# Altium project DMC02.PrjPcb
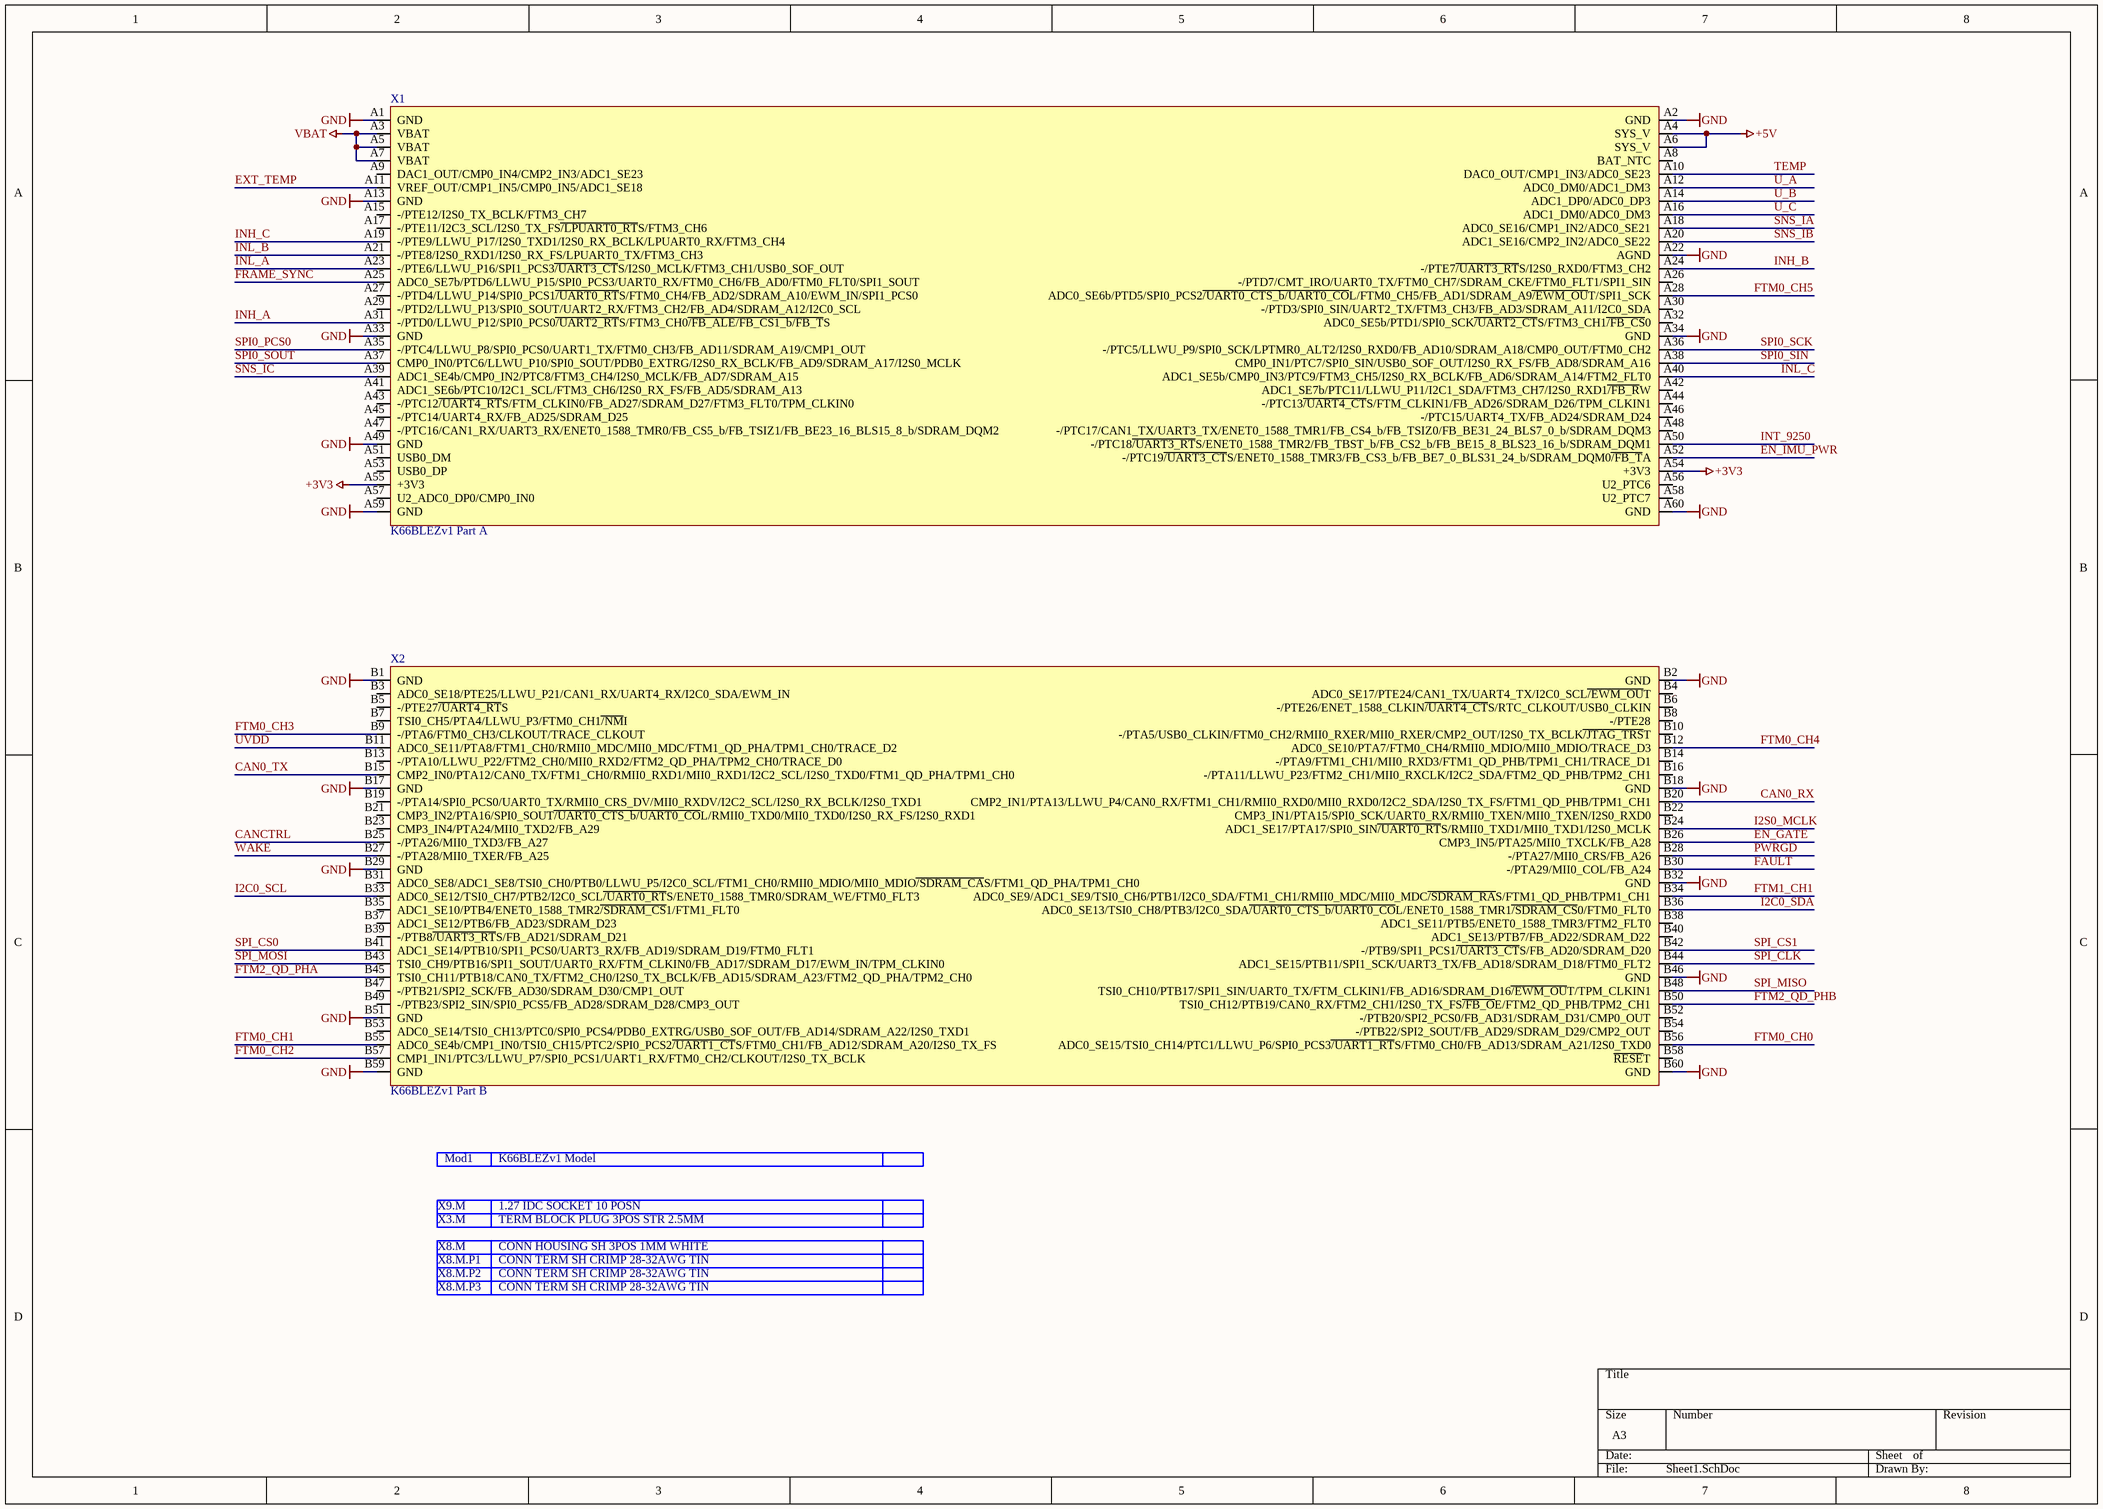
[diagram p0: Sheet1.SchDoc]
2 sheets, 130 parts. Net scope: global (net labels, ports and power ports of the same name join across sheets).
Board file: DMC02.PcbDoc
Sheets:
  Sheet1.SchDoc
  Sheet2.SchDoc

## Sheet Sheet1.SchDoc
size A3

### Parts
Mod1  K66BLEZv1 Model  [K66BLEZv1.0 Mechanical]  (no BOM)
X1  K66BLEZv1 Part A  [K66BLEZv1.0 Part A]
X2  K66BLEZv1 Part B  [K66BLEZv1.0 Part B]
X3.M  TERM BLOCK PLUG 3POS STR 2.5MM
X8.M  CONN HOUSING SH 3POS 1MM WHITE
X8.M.P1  CONN TERM SH CRIMP 28-32AWG TIN
X8.M.P2  CONN TERM SH CRIMP 28-32AWG TIN
X8.M.P3  CONN TERM SH CRIMP 28-32AWG TIN
X9.M  1.27 IDC SOCKET 10 POSN

### Nets
+3V3: X1.A54(+3V3) X1.A55(+3V3)
+5V: X1.A4(SYS_V) X1.A6(SYS_V)
GND: X1.A1(GND) X1.A2(GND) X1.A13(GND) X1.A22(AGND) X1.A33(GND) X1.A34(GND) X1.A49(GND) X1.A59(GND) X1.A60(GND) X2.B1(GND) X2.B2(GND) X2.B17(GND) X2.B18(GND) X2.B29(GND) X2.B32(GND) X2.B46(GND) X2.B51(GND) X2.B59(GND) X2.B60(GND)
VBAT: X1.A3(VBAT) X1.A5(VBAT) X1.A7(VBAT)
CAN0_RX: X2.B20(CMP2_IN1/PTA13/LLWU_P4/CAN0_RX/FTM1_CH1/RMII0_RXD0/MII0_RXD0/I2C2_SDA/I2S0_TX_FS/FTM1_QD_PHB/TPM1_CH1)
CAN0_TX: X2.B15(CMP2_IN0/PTA12/CAN0_TX/FTM1_CH0/RMII0_RXD1/MII0_RXD1/I2C2_SCL/I2S0_TXD0/FTM1_QD_PHA/TPM1_CH0)
CANCTRL: X2.B25(-/PTA26/MII0_TXD3/FB_A27)
EN_GATE: X2.B26(CMP3_IN5/PTA25/MII0_TXCLK/FB_A28)
EN_IMU_PWR: X1.A52(-/PTC19~{/UART3_CT}S/ENET0_1588_TMR3/FB_CS3_b/FB_BE7_0_BLS31_24_b/SDRAM_DQM0~{/FB_T}A)
EXT_TEMP: X1.A11(VREF_OUT/CMP1_IN5/CMP0_IN5/ADC1_SE18)
FAULT: X2.B30(-/PTA29/MII0_COL/FB_A24)
FRAME_SYNC: X1.A25(ADC0_SE7b/PTD6/LLWU_P15/SPI0_PCS3/UART0_RX/FTM0_CH6/FB_AD0/FTM0_FLT0/SPI1_SOUT)
FTM0_CH0: X2.B56(ADC0_SE15/TSI0_CH14/PTC1/LLWU_P6/SPI0_PCS3~{/UART1_RT}S/FTM0_CH0/FB_AD13/SDRAM_A21/I2S0_TXD0)
FTM0_CH1: X2.B55(ADC0_SE4b/CMP1_IN0/TSI0_CH15/PTC2/SPI0_PCS2~{/UART1_CT}S/FTM0_CH1/FB_AD12/SDRAM_A20/I2S0_TX_FS)
FTM0_CH2: X2.B57(CMP1_IN1/PTC3/LLWU_P7/SPI0_PCS1/UART1_RX/FTM0_CH2/CLKOUT/I2S0_TX_BCLK)
FTM0_CH3: X2.B9(-/PTA6/FTM0_CH3/CLKOUT/TRACE_CLKOUT)
FTM0_CH4: X2.B12(ADC0_SE10/PTA7/FTM0_CH4/RMII0_MDIO/MII0_MDIO/TRACE_D3)
FTM0_CH5: X1.A28(ADC0_SE6b/PTD5/SPI0_PCS2~{/UART0_CTS_b/UART0_CO}L/FTM0_CH5/FB_AD1/SDRAM_A9~{/EWM_OU}T/SPI1_SCK)
FTM1_CH1: X2.B34(ADC0_SE9/ADC1_SE9/TSI0_CH6/PTB1/I2C0_SDA/FTM1_CH1/RMII0_MDC/MII0_MDC~{/SDRAM_RA}S/FTM1_QD_PHB/TPM1_CH1)
FTM2_QD_PHA: X2.B45(TSI0_CH11/PTB18/CAN0_TX/FTM2_CH0/I2S0_TX_BCLK/FB_AD15/SDRAM_A23/FTM2_QD_PHA/TPM2_CH0)
FTM2_QD_PHB: X2.B50(TSI0_CH12/PTB19/CAN0_RX/FTM2_CH1/I2S0_TX_FS~{/FB_O}E/FTM2_QD_PHB/TPM2_CH1)
I2C0_SCL: X2.B33(ADC0_SE12/TSI0_CH7/PTB2/I2C0_SCL~{/UART0_RT}S/ENET0_1588_TMR0/SDRAM_WE/FTM0_FLT3)
I2C0_SDA: X2.B36(ADC0_SE13/TSI0_CH8/PTB3/I2C0_SDA~{/UART0_CTS_b/UART0_CO}L/ENET0_1588_TMR1~{/SDRAM_CS}0/FTM0_FLT0)
I2S0_MCLK: X2.B24(ADC1_SE17/PTA17/SPI0_SIN~{/UART0_RT}S/RMII0_TXD1/MII0_TXD1/I2S0_MCLK)
INH_A: X1.A31(-/PTD0/LLWU_P12/SPI0_PCS0~{/UART2_RT}S/FTM3_CH0~{/FB_ALE/FB_CS1_b/FB_T}S)
INH_B: X1.A24(-/PTE7~{/UART3_RT}S/I2S0_RXD0/FTM3_CH2)
INH_C: X1.A19(-/PTE9/LLWU_P17/I2S0_TXD1/I2S0_RX_BCLK/LPUART0_RX/FTM3_CH4)
INL_A: X1.A23(-/PTE6/LLWU_P16/SPI1_PCS3~{/UART3_CT}S/I2S0_MCLK/FTM3_CH1/USB0_SOF_OUT)
INL_B: X1.A21(-/PTE8/I2S0_RXD1/I2S0_RX_FS/LPUART0_TX/FTM3_CH3)
INL_C: X1.A40(ADC1_SE5b/CMP0_IN3/PTC9/FTM3_CH5/I2S0_RX_BCLK/FB_AD6/SDRAM_A14/FTM2_FLT0)
INT_9250: X1.A50(-/PTC18~{/UART3_RT}S/ENET0_1588_TMR2/FB_TBST_b/FB_CS2_b/FB_BE15_8_BLS23_16_b/SDRAM_DQM1)
PWRGD: X2.B28(-/PTA27/MII0_CRS/FB_A26)
SNS_IA: X1.A18(ADC0_SE16/CMP1_IN2/ADC0_SE21)
SNS_IB: X1.A20(ADC1_SE16/CMP2_IN2/ADC0_SE22)
SNS_IC: X1.A39(ADC1_SE4b/CMP0_IN2/PTC8/FTM3_CH4/I2S0_MCLK/FB_AD7/SDRAM_A15)
SPI0_PCS0: X1.A35(-/PTC4/LLWU_P8/SPI0_PCS0/UART1_TX/FTM0_CH3/FB_AD11/SDRAM_A19/CMP1_OUT)
SPI0_SCK: X1.A36(-/PTC5/LLWU_P9/SPI0_SCK/LPTMR0_ALT2/I2S0_RXD0/FB_AD10/SDRAM_A18/CMP0_OUT/FTM0_CH2)
SPI0_SIN: X1.A38(CMP0_IN1/PTC7/SPI0_SIN/USB0_SOF_OUT/I2S0_RX_FS/FB_AD8/SDRAM_A16)
SPI0_SOUT: X1.A37(CMP0_IN0/PTC6/LLWU_P10/SPI0_SOUT/PDB0_EXTRG/I2S0_RX_BCLK/FB_AD9/SDRAM_A17/I2S0_MCLK)
SPI_CLK: X2.B44(ADC1_SE15/PTB11/SPI1_SCK/UART3_TX/FB_AD18/SDRAM_D18/FTM0_FLT2)
SPI_CS0: X2.B41(ADC1_SE14/PTB10/SPI1_PCS0/UART3_RX/FB_AD19/SDRAM_D19/FTM0_FLT1)
SPI_CS1: X2.B42(-/PTB9/SPI1_PCS1~{/UART3_CT}S/FB_AD20/SDRAM_D20)
SPI_MISO: X2.B48(TSI0_CH10/PTB17/SPI1_SIN/UART0_TX/FTM_CLKIN1/FB_AD16/SDRAM_D16~{/EWM_OU}T/TPM_CLKIN1)
SPI_MOSI: X2.B43(TSI0_CH9/PTB16/SPI1_SOUT/UART0_RX/FTM_CLKIN0/FB_AD17/SDRAM_D17/EWM_IN/TPM_CLKIN0)
TEMP: X1.A10(DAC0_OUT/CMP1_IN3/ADC0_SE23)
U_A: X1.A12(ADC0_DM0/ADC1_DM3)
U_B: X1.A14(ADC1_DP0/ADC0_DP3)
U_C: X1.A16(ADC1_DM0/ADC0_DM3)
UVDD: X2.B11(ADC0_SE11/PTA8/FTM1_CH0/RMII0_MDC/MII0_MDC/FTM1_QD_PHA/TPM1_CH0/TRACE_D2)
WAKE: X2.B27(-/PTA28/MII0_TXER/FB_A25)

Not connected (* = marked no-connect by the designer): Mod1 0; X1 A8(BAT_NTC) A9(DAC1_OUT/CMP0_IN4/CMP2_IN3/ADC1_SE23) A15(-/PTE12/I2S0_TX_BCLK/FTM3_CH7) A17(-/PTE11/I2C3_SCL/I2S0_TX_FS~{/LPUART0_RT}S/FTM3_CH6) A26(-/PTD7/CMT_IRO/UART0_TX/FTM0_CH7/SDRAM_CKE/FTM0_FLT1/SPI1_SIN) A27(-/PTD4/LLWU_P14/SPI0_PCS1~{/UART0_RT}S/FTM0_CH4/FB_AD2/SDRAM_A10/EWM_IN/SPI1_PCS0) A29(-/PTD2/LLWU_P13/SPI0_SOUT/UART2_RX/FTM3_CH2/FB_AD4/SDRAM_A12/I2C0_SCL) A30(-/PTD3/SPI0_SIN/UART2_TX/FTM3_CH3/FB_AD3/SDRAM_A11/I2C0_SDA) A32(ADC0_SE5b/PTD1/SPI0_SCK~{/UART2_CT}S/FTM3_CH1~{/FB_CS}0) A41(ADC1_SE6b/PTC10/I2C1_SCL/FTM3_CH6/I2S0_RX_FS/FB_AD5/SDRAM_A13) A42(ADC1_SE7b/PTC11/LLWU_P11/I2C1_SDA/FTM3_CH7/I2S0_RXD1~{/FB_R}W) A43(-/PTC12~{/UART4_RT}S/FTM_CLKIN0/FB_AD27/SDRAM_D27/FTM3_FLT0/TPM_CLKIN0) A44(-/PTC13~{/UART4_CT}S/FTM_CLKIN1/FB_AD26/SDRAM_D26/TPM_CLKIN1) A45(-/PTC14/UART4_RX/FB_AD25/SDRAM_D25) A46(-/PTC15/UART4_TX/FB_AD24/SDRAM_D24) A47(-/PTC16/CAN1_RX/UART3_RX/ENET0_1588_TMR0/FB_CS5_b/FB_TSIZ1/FB_BE23_16_BLS15_8_b/SDRAM_DQM2) A48(-/PTC17/CAN1_TX/UART3_TX/ENET0_1588_TMR1/FB_CS4_b/FB_TSIZ0/FB_BE31_24_BLS7_0_b/SDRAM_DQM3) A51(USB0_DM) A53(USB0_DP) A56(U2_PTC6) A57(U2_ADC0_DP0/CMP0_IN0) A58(U2_PTC7); X2 B3(ADC0_SE18/PTE25/LLWU_P21/CAN1_RX/UART4_RX/I2C0_SDA/EWM_IN) B4(ADC0_SE17/PTE24/CAN1_TX/UART4_TX/I2C0_SCL~{/EWM_OU}T) B5(-/PTE27~{/UART4_RT}S) B6(-/PTE26/ENET_1588_CLKIN~{/UART4_CT}S/RTC_CLKOUT/USB0_CLKIN) B7(TSI0_CH5/PTA4/LLWU_P3/FTM0_CH1~{/NM}I) B8(-/PTE28) B10(-/PTA5/USB0_CLKIN/FTM0_CH2/RMII0_RXER/MII0_RXER/CMP2_OUT/I2S0_TX_BCLK~{/JTAG_TRS}T) B13(-/PTA10/LLWU_P22/FTM2_CH0/MII0_RXD2/FTM2_QD_PHA/TPM2_CH0/TRACE_D0) B14(-/PTA9/FTM1_CH1/MII0_RXD3/FTM1_QD_PHB/TPM1_CH1/TRACE_D1) B16(-/PTA11/LLWU_P23/FTM2_CH1/MII0_RXCLK/I2C2_SDA/FTM2_QD_PHB/TPM2_CH1) B19(-/PTA14/SPI0_PCS0/UART0_TX/RMII0_CRS_DV/MII0_RXDV/I2C2_SCL/I2S0_RX_BCLK/I2S0_TXD1) B21(CMP3_IN2/PTA16/SPI0_SOUT~{/UART0_CTS_b/UART0_CO}L/RMII0_TXD0/MII0_TXD0/I2S0_RX_FS/I2S0_RXD1) B22(CMP3_IN1/PTA15/SPI0_SCK/UART0_RX/RMII0_TXEN/MII0_TXEN/I2S0_RXD0) B23(CMP3_IN4/PTA24/MII0_TXD2/FB_A29) B31(ADC0_SE8/ADC1_SE8/TSI0_CH0/PTB0/LLWU_P5/I2C0_SCL/FTM1_CH0/RMII0_MDIO/MII0_MDIO~{/SDRAM_CA}S/FTM1_QD_PHA/TPM1_CH0) B35(ADC1_SE10/PTB4/ENET0_1588_TMR2~{/SDRAM_CS}1/FTM1_FLT0) B37(ADC1_SE12/PTB6/FB_AD23/SDRAM_D23) B38(ADC1_SE11/PTB5/ENET0_1588_TMR3/FTM2_FLT0) B39(-/PTB8~{/UART3_RT}S/FB_AD21/SDRAM_D21) B40(ADC1_SE13/PTB7/FB_AD22/SDRAM_D22) B47(-/PTB21/SPI2_SCK/FB_AD30/SDRAM_D30/CMP1_OUT) B49(-/PTB23/SPI2_SIN/SPI0_PCS5/FB_AD28/SDRAM_D28/CMP3_OUT) B52(-/PTB20/SPI2_PCS0/FB_AD31/SDRAM_D31/CMP0_OUT) B53(ADC0_SE14/TSI0_CH13/PTC0/SPI0_PCS4/PDB0_EXTRG/USB0_SOF_OUT/FB_AD14/SDRAM_A22/I2S0_TXD1) B54(-/PTB22/SPI2_SOUT/FB_AD29/SDRAM_D29/CMP2_OUT) B58(~{RESE}T); X3.M 0; X8.M 0; X8.M.P1 0; X8.M.P2 0; X8.M.P3 0; X9.M 0

### Library data of the parts
X1 = K66BLEZv1 Part A: 60 Position Connector Header, Outer Shroud Contacts Surface Mount Gold; Manufacturer: Hirose Electric Co Ltd; PartName: FX6-60P-0.8SV(71); PartNum: H10787-ND; Distributor: Digi-Key
X2 = K66BLEZv1 Part B: 60 Position Connector Header, Outer Shroud Contacts Surface Mount Gold; Manufacturer: Hirose Electric Co Ltd; PartName: FX6-60P-0.8SV(71); PartNum: H10787-ND; Distributor: Digi-Key
X3.M = BOM item: 3 Position Terminal Block Plug, Female Sockets 0.098" (2.50mm) 180° Free Hanging (In-Line); Manufacturer: Phoenix Contact; PartName: 1709459; PartNum: 277-11811-ND; Distributor: Digi-Key
X8.M = BOM item: 3 Position Rectangular Housing Connector Receptacle Natural 0.039" (1.00mm); Manufacturer: JST Sales America Inc.; PartName: SHR-03V-S; PartNum: 455-1393-ND; Distributor: Digi-Key
X8.M.P1-X8.M.P3 = BOM item: Contact Crimp Socket 28-32 AWG Tin; Manufacturer: JST Sales America Inc.; PartName: SSH-003T-P0.2; PartNum: 455-1561-1-ND; Distributor: Digi-Key
X9.M = BOM item: 10 Position Rectangular Receptacle Connector IDC Gold 30 AWG; Manufacturer: CNC Tech; PartName: 3230-10-0101-00; PartNum: 1175-1645-ND; Distributor: Digi-Key

## Sheet Sheet2.SchDoc
size A3
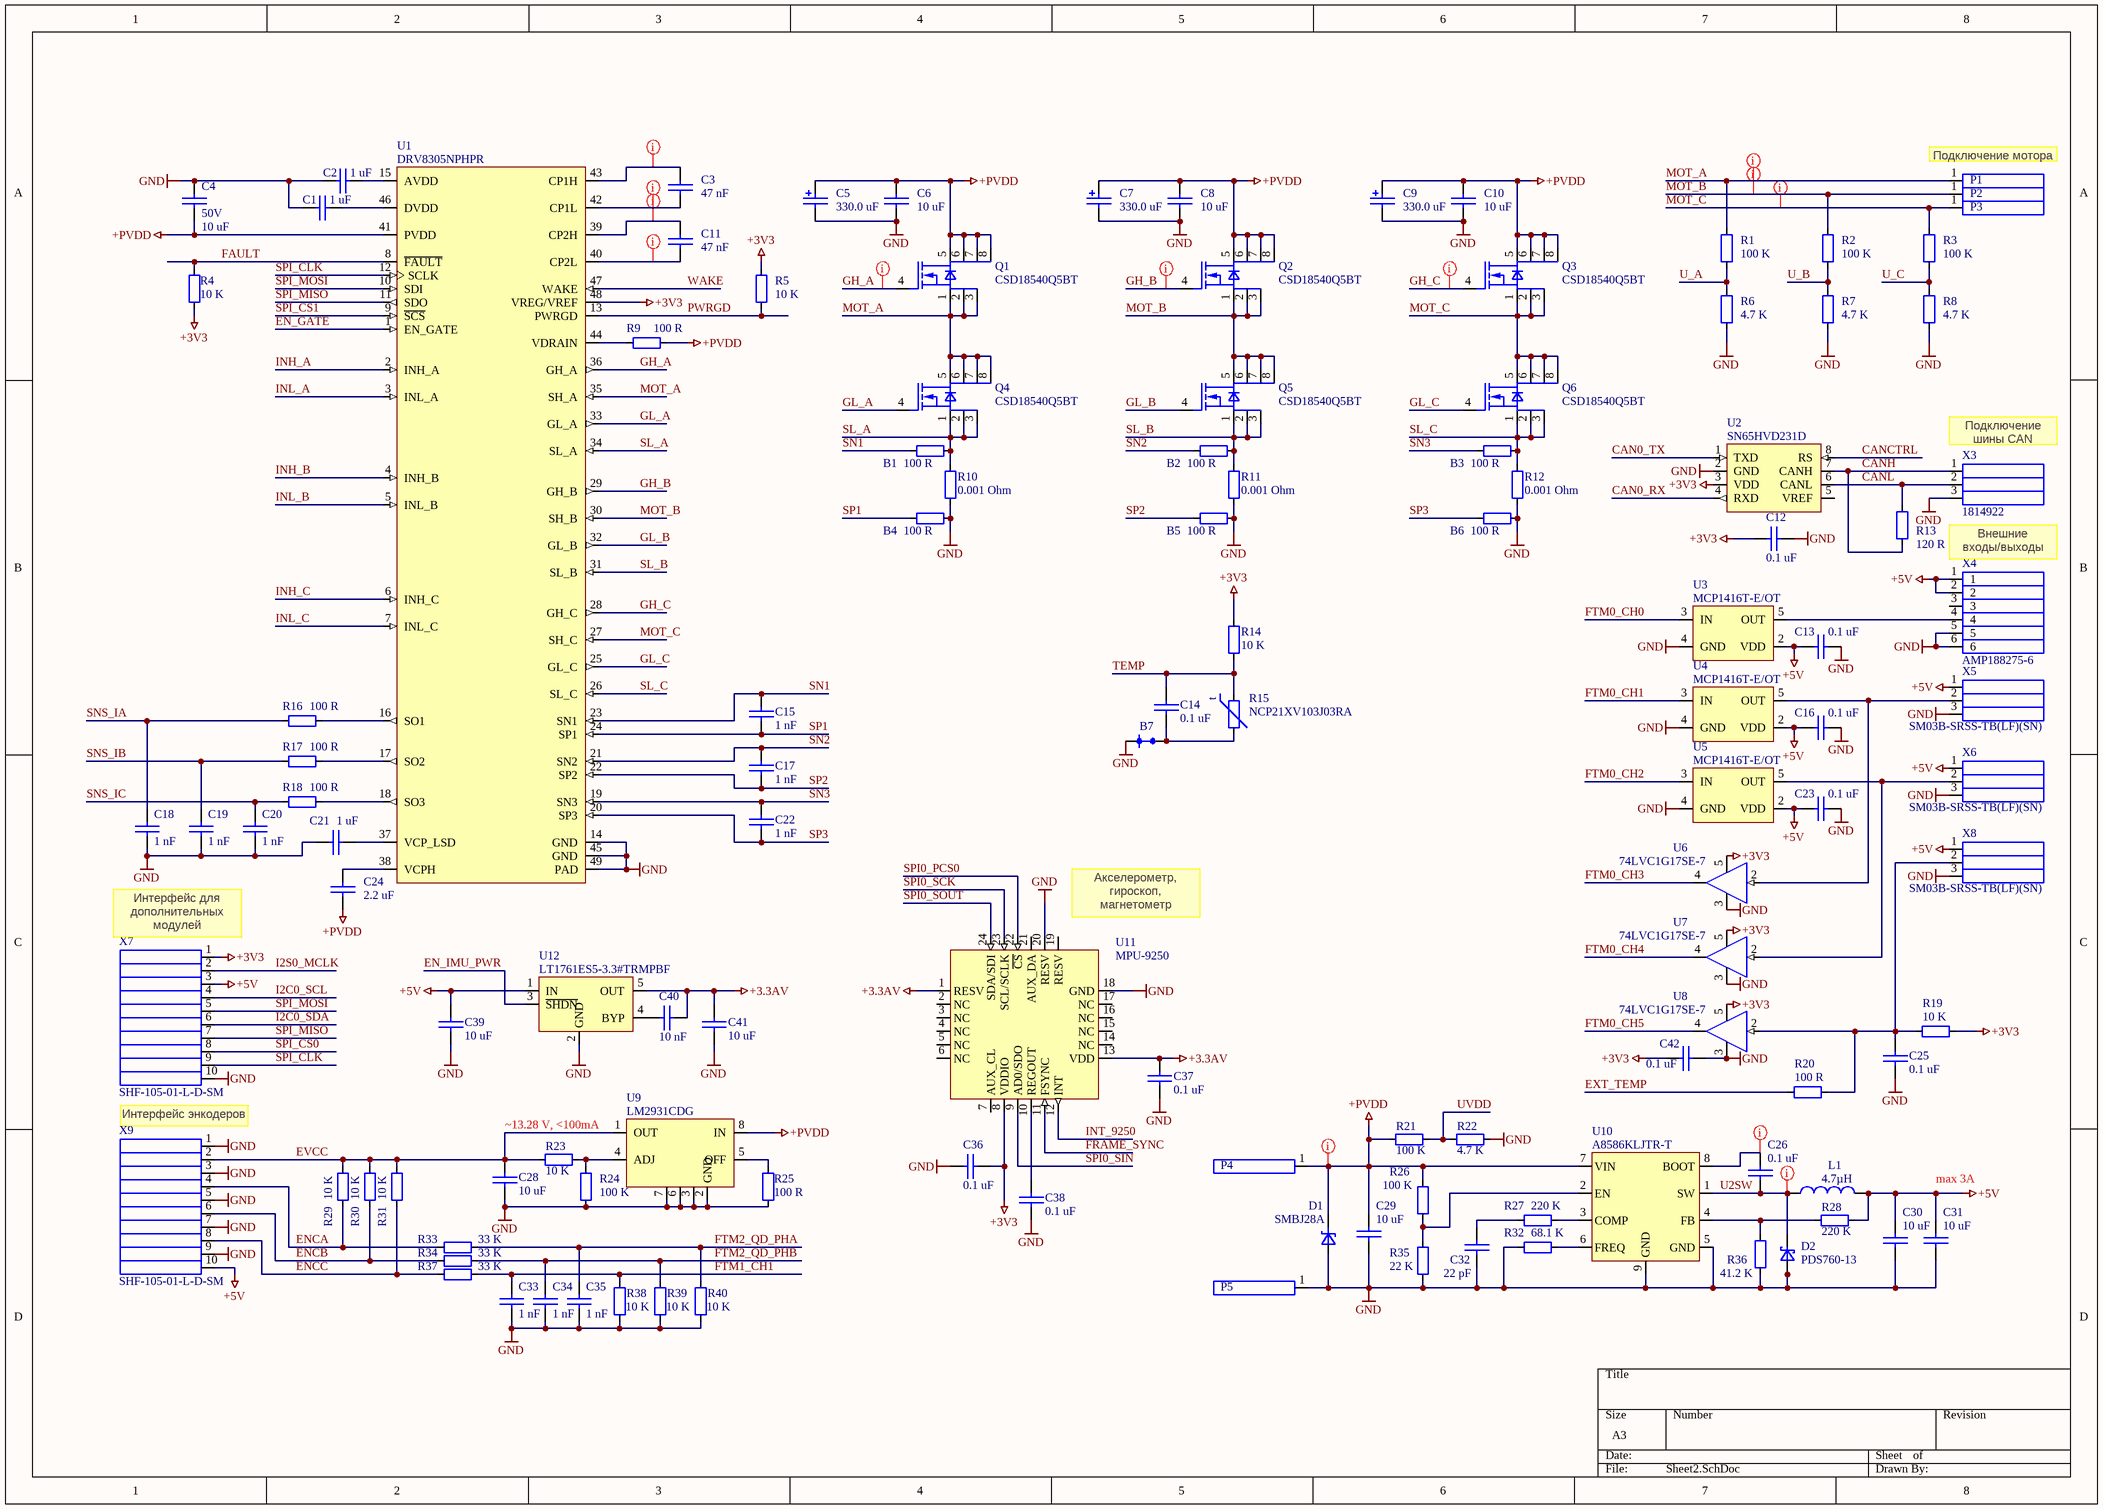
[diagram p1: Sheet2.SchDoc]

### Parts
B1  value 100 R  [0603]  (hidden comment: RL0603E100-1)
B2  value 100 R  [0603]  (hidden comment: RL0603E100-1)
B3  value 100 R  [0603]  (hidden comment: RL0603E100-1)
B4  value 100 R  [0603]  (hidden comment: RL0603E100-1)
B5  value 100 R  [0603]  (hidden comment: RL0603E100-1)
B6  value 100 R  [0603]  (hidden comment: RL0603E100-1)
B7  Net tie 0603  [Net tee 0603]  (value not drawn)  (net tie, no BOM)
C1  value 1 uF  [1608[0603]]  (hidden comment: C1608X7R1C105K080AC)
C2  value 1 uF  [1608[0603]]  (hidden comment: C1608X7R1C105K080AC)
C3  value 47 nF  [1608[0603]]  (hidden comment: C0603C473K1RACTU)
C4  value 10 uF  Voltage: 50V  [3225[1210]]  (hidden comment: GRM32DF51H106ZA01L)
C5  value 330.0 uF  [UUD1V331MNL1GS]  (hidden comment: EEE-FT1H331AP)
C6  value 10 uF  [3225[1210]]  (hidden comment: GRM32DF51H106ZA01L)
C7  value 330.0 uF  [UUD1V331MNL1GS]  (hidden comment: EEE-FT1H331AP)
C8  value 10 uF  [3225[1210]]  (hidden comment: GRM32DF51H106ZA01L)
C9  value 330.0 uF  [UUD1V331MNL1GS]  (hidden comment: EEE-FT1H331AP)
C10  value 10 uF  [3225[1210]]  (hidden comment: GRM32DF51H106ZA01L)
C11  value 47 nF  [1608[0603]]  (hidden comment: C0603C473K1RACTU)
C12  value 0.1 uF  [1608[0603]]  (hidden comment: CL10B104KA8NNND)
C13  value 0.1 uF  [1608[0603]]  (hidden comment: CL10B104KA8NNND)
C14  value 0.1 uF  [1608[0603]]  (hidden comment: CL10B104KA8NNND)
C15  value 1 nF  [1608[0603]]  (hidden comment: CVNF1.0K0603)
C16  value 0.1 uF  [1608[0603]]  (hidden comment: CL10B104KA8NNND)
C17  value 1 nF  [1608[0603]]  (hidden comment: CVNF1.0K0603)
C18  value 1 nF  [1608[0603]]  (hidden comment: CVNF1.0K0603)
C19  value 1 nF  [1608[0603]]  (hidden comment: CVNF1.0K0603)
C20  value 1 nF  [1608[0603]]  (hidden comment: CVNF1.0K0603)
C21  value 1 uF  [1608[0603]]  (hidden comment: C1608X7R1C105K080AC)
C22  value 1 nF  [1608[0603]]  (hidden comment: CVNF1.0K0603)
C23  value 0.1 uF  [1608[0603]]  (hidden comment: CL10B104KA8NNND)
C24  value 2.2 uF  [3225[1210]]  (hidden comment: GRM32ER72A225KA35L)
C25  value 0.1 uF  [1608[0603]]  (hidden comment: CL10B104KA8NNND)
C26  value 0.1 uF  [1608[0603]]  (hidden comment: CL10B104KA8NNND)
C28  value 10 uF  [3225[1210]]  (hidden comment: GRM32DF51H106ZA01L)
C29  value 10 uF  [3225[1210]]  (hidden comment: GRM32DF51H106ZA01L)
C30  value 10 uF  [0805-1206]  (hidden comment: LMK212F106ZG-T)
C31  value 10 uF  [0805-1206]  (hidden comment: LMK212F106ZG-T)
C32  value 22 pF  [1608[0603]]  (hidden comment: CCPF022K0603)
C33  value 1 nF  [1608[0603]]  (hidden comment: CVNF1.0K0603)
C34  value 1 nF  [1608[0603]]  (hidden comment: CVNF1.0K0603)
C35  value 1 nF  [1608[0603]]  (hidden comment: CVNF1.0K0603)
C36  value 0.1 uF  [1608[0603]]  (hidden comment: CVNF100K0603-25)
C37  value 0.1 uF  [1608[0603]]  (hidden comment: CVNF100K0603-25)
C38  value 0.1 uF  [1608[0603]]  (hidden comment: CVNF100K0603-25)
C39  value 10 uF  [MK212-G (0805)]  (hidden comment: LMK212B7106KG-TD)
C40  value 10 nF  [1608[0603]]  (hidden comment: CVNF010K0603)
C41  value 10 uF  [MK212-G (0805)]  (hidden comment: LMK212B7106KG-TD)
C42  value 0.1 uF  [1608[0603]]  (hidden comment: CL10B104KA8NNND)
D1  SMBJ28A  [DO-214AA_SMBJ]
D2  PDS760-13  [PowerDI 5]
L1  value 4.7µH  [SRU8043 Bourns]  (hidden comment: SRU8043-4R7Y)
P1  Keystone 1212  [Keystone 1212]  (value not drawn)
P2  Keystone 1212  [Keystone 1212]  (value not drawn)
P3  Keystone 1212  [Keystone 1212]  (value not drawn)
P4  Keystone 1212  [Keystone 1212]  (value not drawn)
P5  Keystone 1212  [Keystone 1212]  (value not drawn)
Q1  CSD18540Q5BT  [TI Q5B]
Q2  CSD18540Q5BT  [TI Q5B]
Q3  CSD18540Q5BT  [TI Q5B]
Q4  CSD18540Q5BT  [TI Q5B]
Q5  CSD18540Q5BT  [TI Q5B]
Q6  CSD18540Q5BT  [TI Q5B]
R1  value 100 K  [3216[1206]]  (hidden comment: CRCW1206100KFKEA)
R2  value 100 K  [3216[1206]]  (hidden comment: CRCW1206100KFKEA)
R3  value 100 K  [3216[1206]]  (hidden comment: CRCW1206100KFKEA)
R4  value 10 K  [0603]  (hidden comment: RL0603K010-1)
R5  value 10 K  [0603]  (hidden comment: RL0603K010-1)
R6  value 4.7 K  [0603]  (hidden comment: RL0603K004.7-1)
R7  value 4.7 K  [0603]  (hidden comment: RL0603K004.7-1)
R8  value 4.7 K  [0603]  (hidden comment: RL0603K004.7-1)
R9  value 100 R  [0603]  (hidden comment: RL0603E100-1)
R10  value 0.001 Ohm  [CSNL2512 1mOhm]  (hidden comment: CSNL2512FT1L00)
R11  value 0.001 Ohm  [CSNL2512 1mOhm]  (hidden comment: CSNL2512FT1L00)
R12  value 0.001 Ohm  [CSNL2512 1mOhm]  (hidden comment: CSNL2512FT1L00)
R13  value 120 R  [0603]  (hidden comment: RL0603E120-1)
R14  value 10 K  [0603]  (hidden comment: RL0603K010-1)
R15  NCP21XV103J03RA  [0805]
R16  value 100 R  [0603]  (hidden comment: RL0603E100-1)
R17  value 100 R  [0603]  (hidden comment: RL0603E100-1)
R18  value 100 R  [0603]  (hidden comment: RL0603E100-1)
R19  value 10 K  [0603]  (hidden comment: RL0603K010-1)
R20  value 100 R  [0603]  (hidden comment: RL0603E100-1)
R21  value 100 K  [0603]  (hidden comment: RL0603K100-1)
R22  value 4.7 K  [0603]  (hidden comment: RL0603K004.7-1)
R23  value 10 K  [0603]  (hidden comment: RL0603K010-1)
R24  value 100 K  [0603]  (hidden comment: RL0603K100-1)
R25  value 100 R  [0603]  (hidden comment: RL0603E100-1)
R26  value 100 K  [0603]  (hidden comment: RL0603K100-1)
R27  value 220 K  [0603]  (hidden comment: RL0603K220-1)
R28  value 220 K  [0603]  (hidden comment: RL0603K220-1)
R29  value 10 K  [0603]  (hidden comment: RL0603K010-1)
R30  value 10 K  [0603]  (hidden comment: RL0603K010-1)
R31  value 10 K  [0603]  (hidden comment: RL0603K010-1)
R32  value 68.1 K  [0603]  (hidden comment: RC0603FR-0768K1L)
R33  value 33 K  [0603]  (hidden comment: RC0603FR-0733KL)
R34  value 33 K  [0603]  (hidden comment: RC0603FR-0733KL)
R35  value 22 K  [0603]  (hidden comment: RL0603K022-1)
R36  value 41.2 K  [0603]  (hidden comment: RC0603FR-0741K2L)
R37  value 33 K  [0603]  (hidden comment: RC0603FR-0733KL)
R38  value 10 K  [0603]  (hidden comment: RL0603K010-1)
R39  value 10 K  [0603]  (hidden comment: RL0603K010-1)
R40  value 10 K  [0603]  (hidden comment: RL0603K010-1)
U1  DRV8305NPHPR  [TI 48-HTQFP]
U2  SN65HVD231D  [SO-8]
U3  MCP1416T-E/OT  [SOT23-5]
U4  MCP1416T-E/OT  [SOT23-5]
U5  MCP1416T-E/OT  [SOT23-5]
U6  74LVC1G17SE-7  [SOT-353 ON Semi]
U7  74LVC1G17SE-7  [SOT-353 ON Semi]
U8  74LVC1G17SE-7  [SOT-353 ON Semi]
U9  LM2931CDG  [SO-8]
U10  A8586KLJTR-T  [LJ 8-Pin SOIC w termal pad]
U11  MPU-9250  [QFN-24 InvenSense]
U12  LT1761ES5-3.3#TRMPBF  [SOT23-5]
X3  1814922  [1814922]
X4  AMP188275-6  [AMP188275-6]
X5  SM03B-SRSS-TB(LF)(SN)  [SM03B-SRSS-TB]
X6  SM03B-SRSS-TB(LF)(SN)  [SM03B-SRSS-TB]
X7  SHF-105-01-L-D-SM  [SHF-105-01-L-D-SM]
X8  SM03B-SRSS-TB(LF)(SN)  [SM03B-SRSS-TB]
X9  SHF-105-01-L-D-SM  [SHF-105-01-L-D-SM]

### Nets
+3.3AV: C37.1 C40.2 C41.1 U11.1(RESV) U11.13(VDD) U12.5(OUT)
+3V3: C12.1 C36.2 C42.2 R4.2 R5.2 R14.2 R19.1 U1.48(VREG/VREF) U2.3(VDD) U6.5(VCC) U7.5(VCC) U8.5(VCC) U11.8(VDDIO) X7.1
+5V: C13.2 C16.2 C23.2 C30.2 C31.2 C39.1 L1.2 R28.1 U3.2(VDD) U4.2(VDD) U5.2(VDD) U12.1(IN) X4.1 X4.2 X5.1 X6.1 X7.3 X8.1 X9.10
+PVDD: C4.1 C5.1 C6.2 C7.1 C8.2 C9.1 C10.2 C24.2 C29.1 D1.1(C) P4.1 Q1.5(D) Q1.6(D) Q1.7(D) Q1.8(D) Q2.5(D) Q2.6(D) Q2.7(D) Q2.8(D) Q3.5(D) Q3.6(D) Q3.7(D) Q3.8(D) R9.2 R21.2 R26.2 U1.41(PVDD) U9.8(IN) U10.7(VIN)
GND: B4.2 B5.2 B6.2 B7.1 C1.1 C2.1 C4.2 C5.2 C6.1 C7.2 C8.1 C9.2 C10.1 C12.2 C13.1 C16.1 C18.2 C19.2 C20.2 C21.1 C23.1 C25.1 C28.1 C29.2 C30.1 C31.1 C32.2 C33.2 C34.2 C35.2 C36.1 C37.2 C38.1 C39.2 C41.2 C42.1 D1.2(A) D2.1 D2.2 P5.1 R6.1 R7.1 R8.1 R10.1 R11.1 R12.1 R22.2 R24.1 R25.2 R32.1 R35.1 R36.1 R38.2 R39.2 R40.2 U1.14(GND) U1.45(GND) U1.49(PAD) U2.2(GND) U3.4(GND) U4.4(GND) U5.4(GND) U6.3(GND) U7.3(GND) U8.3(GND) U9.2(GND) U9.3(GND) U9.6(GND) U9.7(GND) U10.5(GND) U10.9(GND) U11.18(GND) U11.20(RESV) U12.2(GND) X3.3 X4.5 X4.6 X5.3 X6.3 X7.10 X8.3 X9.1 X9.3 X9.5 X9.7 X9.9
CAN0_RX: U2.4(RXD)
CAN0_TX: U2.1(TXD)
CANCTRL: U2.8(RS)
CANH: R13.1 U2.7(CANH) X3.1
CANL: R13.2 U2.6(CANL) X3.2
EN_GATE: U1.1(EN_GATE)
EN_IMU_PWR: U12.3(~{SHDN})
ENCA: R29.1 R33.2 X9.4
ENCB: R30.1 R34.2 X9.6
ENCC: R31.1 R37.2 X9.8
EVCC: C28.2 R23.2 R29.2 R30.2 R31.2 U9.1(OUT) X9.2
EXT_TEMP: R20.1
FAULT: R4.1 U1.8(~{FAULT})
FRAME_SYNC: U11.11(FSYNC)
FTM0_CH0: U3.3(IN)
FTM0_CH1: U4.3(IN)
FTM0_CH2: U5.3(IN)
FTM0_CH3: U6.4(Y)
FTM0_CH4: U7.4(Y)
FTM0_CH5: U8.4(Y)
FTM1_CH1: C33.1 R37.1 R38.1
FTM2_QD_PHA: C35.1 R33.1 R40.1
FTM2_QD_PHB: C34.1 R34.1 R39.1
GH_A: Q1.4(G) U1.36(GH_A)
GH_B: Q2.4(G) U1.29(GH_B)
GH_C: Q3.4(G) U1.28(GH_C)
GL_A: Q4.4(G) U1.33(GL_A)
GL_B: Q5.4(G) U1.32(GL_B)
GL_C: Q6.4(G) U1.25(GL_C)
I2C0_SCL: X7.4
I2C0_SDA: X7.6
I2S0_MCLK: X7.2
INH_A: U1.2(INH_A)
INH_B: U1.4(INH_B)
INH_C: U1.6(INH_C)
INL_A: U1.3(INL_A)
INL_B: U1.5(INL_B)
INL_C: U1.7(INL_C)
INT_9250: U11.12(INT)
MOT_A: P1.1 Q1.1(S) Q1.2(S) Q1.3(S) Q4.5(D) Q4.6(D) Q4.7(D) Q4.8(D) R1.2 U1.35(SH_A)
MOT_B: P2.1 Q2.1(S) Q2.2(S) Q2.3(S) Q5.5(D) Q5.6(D) Q5.7(D) Q5.8(D) R2.2 U1.30(SH_B)
MOT_C: P3.1 Q3.1(S) Q3.2(S) Q3.3(S) Q6.5(D) Q6.6(D) Q6.7(D) Q6.8(D) R3.2 U1.27(SH_C)
PWRGD: R5.1 U1.13(PWRGD)
SL_A: B1.2 Q4.1(S) Q4.2(S) Q4.3(S) R10.2 U1.34(SL_A)
SL_B: B2.2 Q5.1(S) Q5.2(S) Q5.3(S) R11.2 U1.31(SL_B)
SL_C: B3.2 Q6.1(S) Q6.2(S) Q6.3(S) R12.2 U1.26(SL_C)
SN1: B1.1 C15.2 U1.23(SN1)
SN2: B2.1 C17.2 U1.21(SN2)
SN3: B3.1 C22.2 U1.19(SN3)
SNS_IA: C18.1 R16.1
SNS_IB: C19.1 R17.1
SNS_IC: C20.1 R18.1
SP1: B4.1 C15.1 U1.24(SP1)
SP2: B5.1 C17.1 U1.22(SP2)
SP3: B6.1 C22.1 U1.20(SP3)
SPI0_PCS0: U11.22(~{CS})
SPI0_SCK: U11.23(SCL/SCLK)
SPI0_SIN: U11.9(AD0/SDO)
SPI0_SOUT: U11.24(SDA/SDI)
SPI_CLK: U1.12(SCLK) X7.9
SPI_CS0: X7.8
SPI_CS1: U1.9(~{SCS})
SPI_MISO: U1.11(SDO) X7.7
SPI_MOSI: U1.10(SDI) X7.5
TEMP: C14.2 R14.1 R15.2
U2SW: C26.1 D2.3 L1.1 U10.1(SW)
U_A: R1.1 R6.2
U_B: R2.1 R7.2
U_C: R3.1 R8.2
UVDD: R21.1 R22.1
WAKE: U1.47(WAKE)
NetB7_2: B7.2 C14.1 R15.1
NetC1_2: C1.2 U1.46(DVDD)
NetC2_2: C2.2 U1.15(AVDD)
NetC3_1: C3.1 U1.43(CP1H)
NetC3_2: C3.2 U1.42(CP1L)
NetC11_1: C11.1 U1.39(CP2H)
NetC11_2: C11.2 U1.40(CP2L)
NetC21_2: C21.2 U1.37(VCP_LSD)
NetC24_1: C24.1 U1.38(VCPH)
NetC25_2: C25.2 R19.2 R20.2 U8.2(A) X8.2
NetC26_2: C26.2 U10.8(BOOT)
NetC32_1: C32.1 R27.2
NetC38_2: C38.2 U11.10(REGOUT)
NetC40_1: C40.1 U12.4(BYP)
NetR9_1: R9.1 U1.44(VDRAIN)
NetR16_2: R16.2 U1.16(SO1)
NetR17_2: R17.2 U1.17(SO2)
NetR18_2: R18.2 U1.18(SO3)
NetR23_1: R23.1 R24.2 U9.4(ADJ)
NetR25_1: R25.1 U9.5(OFF)
NetR26_1: R26.1 R35.2 U10.2(EN)
NetR27_1: R27.1 U10.3(COMP)
NetR28_2: R28.2 R36.2 U10.4(FB)
NetR32_2: R32.2 U10.6(FREQ)
NetU3_5: U3.5(OUT) X4.4
NetU4_5: U4.5(OUT) U6.2(A) X5.2
NetU5_5: U5.5(OUT) U7.2(A) X6.2

Not connected (* = marked no-connect by the designer): U2 5(VREF); U11 2(NC) 3(NC) 4(NC) 5(NC) 6(NC) 7(AUX_CL) 14(NC) 15(NC) 16(NC) 17(NC) 19(RESV) 21(AUX_DA); X4 3

### Layout directives
net class 24V: +PVDD, GH_A, GH_B, GH_C, MOT_A, MOT_B, MOT_C, NetC3_1, NetC3_2, NetC11_1, NetC11_2, NetC26_2, U2SW

### Notes on the sheet
- Подключение мотора
- (near X3) Подключение шины CAN
- Внешние входы/выходы
- (near U11) Акселерометр,
  гироскоп,
  магнетометр
- (near X7) Интерфейс для дополнительных модулей
- Интерфейс энкодеров
- ~13.28 V, <100mA
- max 3A
- (in symbol NCP21XV103J03RA) t

### Library data of the parts
B1-B6 R9 R16-R18 R20 R25 = RL0603E100-1: 100 R, 1%, 0603, SMD Resistor, Taped; Manufacturer: Vishay; Voltage: 75 V; Distributor: Schukat; Tolerance: ±1%; PartNum: RL0603E100; PartName: RL0603E100
C1 C2 C21 = C1608X7R1C105K080AC: 1 uF, 16V, 10%, X7R, 0603 SMD MLC Capacitor, -55°C ~ 125°C; Manufacturer: TDK Corporation; PartNum: 445-1604-1-ND; Tolerance: ±10%; Distributor: Digi-Key; PartName: C1608X7R1C105K080AC; Voltage: 16 V
C3 C11 = C0603C473K1RACTU: 47 nF, 100V, 10%, X7R, 0603 SMD MLC Capacitor, -55°C ~ 125°C; Manufacturer: Kemet; PartNum: 399-9096-1-ND; Tolerance: ±10%; Distributor: Digi-Key; PartName: C0603C473K1RACTU; Voltage: 100 V
C4 C6 C8 C10 C28 C29 = GRM32DF51H106ZA01L: 10uF, 50V, 20%, Y5V (F), 1210; Manufacturer: Murata Electronics North America; PartNum: 490-1891-1-ND; Tolerance: 20%; PartName: GRM32DF51H106ZA01L
  C4: Distributor: Digi-key
  C6 C8 C10: Distributor: Digi-key; Voltage: 50V
  C28 C29: Distributor: DigiKey; Voltage: 50V
C5 C7 C9 = EEE-FT1H331AP: 330 uF, 50V, 120 mOhm @ 100kHz, 585 mA, 10x10, -50...+105 C; Manufacturer: Panasonic Electronic Components; PartNum: PCE5026CT-ND; Tolerance: ±20%; Voltage: 50 V; Distributor: Digi-Key; PartName: EEE-FT1H331AP
C12-C14 C16 C23 C25 C26 C36-C38 C42 = CVNF100K0603-25: 0.1 uF, 50V, 10% , X7R,  0603 SMD MLC Capacitor; Manufacturer: WALSIN; PartNum: 2496834; PartName: 0603B104K500CT; Tolerance: ±10%; Distributor: Farnell; Voltage: 50 V
C15 C17-C20 C22 C33-C35 = CVNF1.0K0603: 1 nF, 50V, 10%, X7R, 0603 SMD MLC Capacitor; Manufacturer: Darfon; PartNum: 1276-1018-1-ND; PartName: CL10B102KB8NNNC; Tolerance: ±10%; Distributor: Digi-Key; Voltage: 50 V
C24 = GRM32ER72A225KA35L: 2.2 uF, 100 V, ±10%, X7R, 1210, -55°C ~ 125°C; Manufacturer: Murata Electronics North America; PartNum: 490-3385-1-ND; Voltage: 100 V; Tolerance: ±10%; Distributor: Digi-key; PartName: GRM32ER72A225KA35L
C30 C31 = LMK212F106ZG-T: CAP CER 10UF 10V 10% X5R 0805; Manufacturer: Taiyo Yuden; PartNum: 587-2668-1-ND; PartName: LMK212B7106KG-TD; Distributor: Digi-Key; Tolerance: 10%; Voltage: 10V
C32 = CCPF022K0603: 22 pF, 50V, 5%, NP0, 0603 SMD MLC Capacitor; Manufacturer: Darfon; Tolerance: 5%; Distributor: Schukat; PartNum: CCPF022K0603; Voltage: 50 V; PartName: CCPF022K0603
C39 C41 = LMK212B7106KG-TD: 10 uF, 10V, X7R, ±10%, 0805, -55°C ~ 125°C; Manufacturer: Taiyo Yuden; PartNum: 587-2668-1-ND; Distributor: Digi-Key; Tolerance: ±10%; PartName: LMK212B7106KG-TD; Voltage: 10V
C40 = CVNF010K0603: 10 nF, 50V, 10%, X7R, 0603 SMD MLC Capacitor; Manufacturer: Murata Electronics; PartNum: 490-1512-1-ND; PartName: GRM188R71H103KA01D; Tolerance: ±10%; Distributor: Digi-Key; Voltage: 50 V
D1 = SMBJ28A: DIODE TVS 28V 600W UNI 5% SMD; Manufacturer: Littelfuse; PartNum: SMBJ28ABCT-ND; Distributor: Digi-key; PartName: SMBJ28A; Value: 28 V
D2 = PDS760-13: Schottky Power Rectifier 7A, 60V, SMA; Manufacturer: VISHAY; PartNum: PDS760DICT-ND; Distributor: Digi-Key; PartName: PDS760-13
L1 = SRU8043-4R7Y: 4.7µH, 4.6 A, 0.017Ohms, ±30%, -40°C ~ 125°C; Manufacturer: Bourns Inc.; PartNum: SRU8043-4R7YCT-ND; Distributor: Digi-Key; Tolerance: ±30%; PartName: SRU8043-4R7Y
P1-P5 = Keystone_1212: (4.75mm) Quick Connect Male Solder Connector Non-Insulated; Manufacturer: Keystone Electronics; PartNum: 36-1212-ND; Distributor: Digi-Key; PartName: Keystone 1212
Q1-Q6 = CSD18540Q5BT: MOSFET N-CH, 100 A, 60V, 0.0022 Ohm; Manufacturer: Texas Instruments; PartNum: 296-37963-1-ND; Distributor: Digi-Key; PartName: CSD18540Q5BT
R1-R3 = CRCW1206100KFKEA: 100 K, 1%, 1206, SMD Resistor, Taped; Manufacturer: Yageo; PartNum: 311-100KFRCT-ND; PartName: RC1206FR-07100KL; Voltage: 200V; Distributor: Digi-Key; Tolerance: ±1%
R4 R5 R14 R19 R23 R29-R31 R38-R40 = RL0603K010-1: 10 K, 1%, 0603, SMD Resistor, Taped; Manufacturer: Vishay Dale; PartNum: 541-10KGCT-ND; PartName: CRCW060310K0JNEA; Voltage: 75 V; Distributor: Digi-Key; Tolerance: ±1%
R6-R8 R22 = RL0603K004.7-1: 4.7 K, 1%, 0603, SMD Resistor, Taped; Manufacturer: Vishay; Voltage: 75 V; Distributor: Schukat; Tolerance: ±1%; PartNum: RL0603K004.7; PartName: RL0603K004.7
R10-R12 = CSNL2512FT1L00: Curr.sens.res. 0.001 OHM, 2W, 1% , 63A max, ±50ppm/°C, 2512 (6432 Metric); Manufacturer: Stackpole Electronics Inc.; PartNum: CSNL2512FT1L00CT-ND; Distributor: Digi-Key; Tolerance: ±1%; PartName: CSNL2512FT1L00
R13 = RL0603E120-1: 120 R, 1%, 0603, SMD Resistor, Taped; Manufacturer: Vishay; Voltage: 75 V; Distributor: Schukat; Tolerance: ±1%; PartNum: RL0603E120; PartName: RL0603E120
R15 = NCP21XV103J03RA: Thermistor 10k, 0805, NTC; Manufacturer: Murata; PartNum: 490-2456-1-ND; Distributor: Digi-Key; Value: 10K; PartName: NCP21XV103J03RA
R21 R24 R26 = RL0603K100-1: 100 K, 1%, 0603, SMD Resistor, Taped; Manufacturer: Vishay; Voltage: 75 V; Distributor: Schukat; Tolerance: ±1%; PartNum: RL0603K100; PartName: RL0603K100
R27 R28 = RL0603K220-1: 220 K, 1%, 0603, SMD Resistor, Taped; Manufacturer: Yageo; PartNum: 311-220KHRCT-ND; PartName: RC0603FR-07220KL; Voltage: 75 V; Distributor: Digi-Key; Tolerance: ±1%
R32 = RC0603FR-0768K1L: 68.1 K, 1%, 0603, SMD Resistor, -55°C ~ 155°C; Manufacturer: Yageo; PartNum: 311-68.1KHRCT-ND; Distributor: Digi-Key; Tolerance: ±1%; PartName: RC0603FR-0768K1L
R33 R34 R37 = RL0603K033-1_1: 33 K, 1%, 0603, SMD Resistor, Taped; Manufacturer: YAGEO AMERICA CORPORATION; Voltage: 75 V; Distributor: Future; Tolerance: ±1%; PartNum: RC0603FR-0733KL; PartName: RC0603FR-0733KL
R35 = RL0603K022-1: 22 K, 1%, 0603, SMD Resistor, Taped; Manufacturer: Vishay; Voltage: 75 V; Distributor: Schukat; Tolerance: ±1%; PartNum: RL0603K022; PartName: RL0603K022
R36 = RC0603FR-0741K2L: 41.2 K, 1%, 0603, SMD Resistor, -55°C ~ 155°C; Manufacturer: Yageo; PartNum: 311-41.2KHRTR-ND; Distributor: Digi-Key; Tolerance: ±1%; PartName: RC0603FR-0741K2L
U1 = DRV8305NPHPR: Three Phase Automotive Gate Driver with Three Integrated Current Shunt Amplifiers and Voltage Regulator, PHP0048G; Manufacturer: Texas Instruments; PartNum: 296-42659-1-ND; Distributor: Digi-Key; PartName: DRV8305NPHPR
U2 = SN65HVD231D: 3.3-V CAN TRANSCEIVERS SO-8; Manufacturer: Texas Instruments; PartNum: 296-12206-5-ND; Distributor: Digi-Key; PartName: SN65HVD231D
U3-U5 = MCP1416T-E/OT: MOSFET drv 1.5A, 4.5-18 V,   -40..+150C, SOT-23-5; Manufacturer: Microchip Technology; PartNum: MCP1416T-E/OTCT-ND; Distributor: Digi-Key; PartName: MCP1416T-E/OT
U6-U8 = 74LVC1G17SE-7: IC SGL SCHMITT BUFFER SOT353; Manufacturer: Diodes Incorporated; PartNum: 74LVC1G17SE-7CT-ND; Distributor: Digi-Key; PartName: 74LVC1G17SE-7
U9 = LM2931CDG: 100 mA ,  Adj, SO-8; Manufacturer: ON Semiconductor; PartNum: LM2931CDGOS-ND; Distributor: Digi-Key; PartName: LM2931CDG
U10 = A8586KLJTR-T: IC REG 36V 3.5A, STEP DOWN 8-SOIC,-40°C ~ 150°C; Manufacturer: Allegro Microsystems Inc; PartNum: 620-1716-1-ND; Distributor: Digi-Key; PartName: A8586KLJTR-T
U11 = MPU-9250: Accelerometer, Gyroscope, Magnetometer, 3 Axis Sensor I2C, SPI Output, -40...+85 C, 24QFN; Manufacturer: InvenSense; PartNum: 1428-1019-1-ND; Distributor: Digi-Key; PartName: MPU-9250
U12 = LT1761ES5-3.3#TRMPBF: Low noice LDO 3.3V, Vin=2.7-20V, 300 mV at 100mA, -40...+125C, TSOT-23-5; Manufacturer: Linear Technology; PartNum: LT1761ES5-3.3#TRMPBFCT-ND; Distributor: Digi-Key; PartName: LT1761ES5-3.3#TRMPBF
X3 = 1814922: SSL Connector 3 Position Header, Male Pins Board to Cable/Wire 0.098" (2.50mm) Solder; Manufacturer: Phoenix Contact; PartNum: 277-9964-1-ND; Distributor: Digi-Key; PartName: 1814922
X4 = AMP188275-6: SMD Connector Female 6-Pole; Manufacturer: AMP; PartNum: 7-188275-6; Distributor: Digi-Key; PartName: 7-188275-6
X5 X6 X8 = SM03B-SRSS-TB(LF)(SN): CONN HEADER SH 3POS SIDE 1MM TIN; Manufacturer: JST Sales America Inc.; PartNum: 455-1803-1-ND; Distributor: Digi-Key; PartName: SM03B-SRSS-TB(LF)(SN)
X7 X9 = SHF-105-01-L-D-SM: 10 Positions Header Connector 0.050" (1.27mm) Surface Mount Gold; Manufacturer: Samtec Inc.; PartNum: SAM8765-ND; PartName: SHF-105-01-L-D-SM
  X7: Distributor: Digi-Key
  X9: Distributor: Digi-key

## Nets that join several sheets
+3V3: Sheet1 (X1.A54 X1.A55), Sheet2 (14 pins)
+5V: Sheet1 (X1.A4 X1.A6), Sheet2 (19 pins)
GND: Sheet1 (19 pins), Sheet2 (86 pins)
CAN0_RX: Sheet1 (X2.B20), Sheet2 (U2.4)
CAN0_TX: Sheet1 (X2.B15), Sheet2 (U2.1)
CANCTRL: Sheet1 (X2.B25), Sheet2 (U2.8)
EN_GATE: Sheet1 (X2.B26), Sheet2 (U1.1)
EN_IMU_PWR: Sheet1 (X1.A52), Sheet2 (U12.3)
EXT_TEMP: Sheet1 (X1.A11), Sheet2 (R20.1)
FAULT: Sheet1 (X2.B30), Sheet2 (R4.1 U1.8)
FRAME_SYNC: Sheet1 (X1.A25), Sheet2 (U11.11)
FTM0_CH0: Sheet1 (X2.B56), Sheet2 (U3.3)
FTM0_CH1: Sheet1 (X2.B55), Sheet2 (U4.3)
FTM0_CH2: Sheet1 (X2.B57), Sheet2 (U5.3)
FTM0_CH3: Sheet1 (X2.B9), Sheet2 (U6.4)
FTM0_CH4: Sheet1 (X2.B12), Sheet2 (U7.4)
FTM0_CH5: Sheet1 (X1.A28), Sheet2 (U8.4)
FTM1_CH1: Sheet1 (X2.B34), Sheet2 (C33.1 R37.1 R38.1)
FTM2_QD_PHA: Sheet1 (X2.B45), Sheet2 (C35.1 R33.1 R40.1)
FTM2_QD_PHB: Sheet1 (X2.B50), Sheet2 (C34.1 R34.1 R39.1)
I2C0_SCL: Sheet1 (X2.B33), Sheet2 (X7.4)
I2C0_SDA: Sheet1 (X2.B36), Sheet2 (X7.6)
I2S0_MCLK: Sheet1 (X2.B24), Sheet2 (X7.2)
INH_A: Sheet1 (X1.A31), Sheet2 (U1.2)
INH_B: Sheet1 (X1.A24), Sheet2 (U1.4)
INH_C: Sheet1 (X1.A19), Sheet2 (U1.6)
INL_A: Sheet1 (X1.A23), Sheet2 (U1.3)
INL_B: Sheet1 (X1.A21), Sheet2 (U1.5)
INL_C: Sheet1 (X1.A40), Sheet2 (U1.7)
INT_9250: Sheet1 (X1.A50), Sheet2 (U11.12)
PWRGD: Sheet1 (X2.B28), Sheet2 (R5.1 U1.13)
SNS_IA: Sheet1 (X1.A18), Sheet2 (C18.1 R16.1)
SNS_IB: Sheet1 (X1.A20), Sheet2 (C19.1 R17.1)
SNS_IC: Sheet1 (X1.A39), Sheet2 (C20.1 R18.1)
SPI0_PCS0: Sheet1 (X1.A35), Sheet2 (U11.22)
SPI0_SCK: Sheet1 (X1.A36), Sheet2 (U11.23)
SPI0_SIN: Sheet1 (X1.A38), Sheet2 (U11.9)
SPI0_SOUT: Sheet1 (X1.A37), Sheet2 (U11.24)
SPI_CLK: Sheet1 (X2.B44), Sheet2 (U1.12 X7.9)
SPI_CS0: Sheet1 (X2.B41), Sheet2 (X7.8)
SPI_CS1: Sheet1 (X2.B42), Sheet2 (U1.9)
SPI_MISO: Sheet1 (X2.B48), Sheet2 (U1.11 X7.7)
SPI_MOSI: Sheet1 (X2.B43), Sheet2 (U1.10 X7.5)
TEMP: Sheet1 (X1.A10), Sheet2 (C14.2 R14.1 R15.2)
U_A: Sheet1 (X1.A12), Sheet2 (R1.1 R6.2)
U_B: Sheet1 (X1.A14), Sheet2 (R2.1 R7.2)
U_C: Sheet1 (X1.A16), Sheet2 (R3.1 R8.2)
UVDD: Sheet1 (X2.B11), Sheet2 (R21.1 R22.1)
WAKE: Sheet1 (X2.B27), Sheet2 (U1.47)

## Assembly variants
Base Variant: not fitted C9 C36 C37 C38 C39 C40 C41 C42 U4 U5 U6 U8 U11 U12 X5